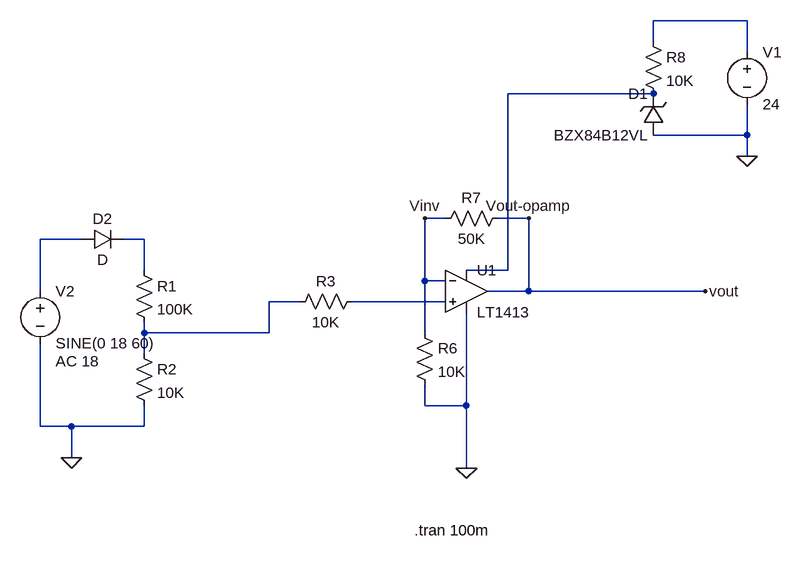
[diagram p0: schematic cspg_dc_voltage_sense_amp.asc]
cspg_dc_voltage_sense_amp.asc, the LTspice schematic file:
Version 4
SHEET 1 1316 680
WIRE 1056 -272 912 -272
WIRE 912 -240 912 -272
WIRE 1056 -224 1056 -272
WIRE 912 -160 688 -160
WIRE 1056 -96 1056 -144
WIRE 1056 -96 912 -96
WIRE 1056 -64 1056 -96
WIRE 592 32 560 32
WIRE 720 32 672 32
WIRE 32 64 -32 64
WIRE 128 64 96 64
WIRE 128 112 128 64
WIRE 688 112 688 -160
WIRE 688 112 624 112
WIRE 560 128 560 32
WIRE 592 128 560 128
WIRE -32 144 -32 64
WIRE 720 144 720 32
WIRE 720 144 656 144
WIRE 992 144 720 144
WIRE 368 160 320 160
WIRE 592 160 448 160
WIRE 128 208 128 192
WIRE 320 208 320 160
WIRE 320 208 128 208
WIRE 560 208 560 128
WIRE 128 240 128 208
WIRE 560 320 560 288
WIRE 624 320 624 176
WIRE 624 320 560 320
WIRE -32 352 -32 224
WIRE 16 352 -32 352
WIRE 128 352 128 320
WIRE 128 352 16 352
WIRE 16 400 16 352
WIRE 624 416 624 320
FLAG 1056 -64 0
FLAG 624 416 0
FLAG 560 32 Vinv
FLAG 720 32 Vout-opamp
FLAG 992 144 vout
FLAG 16 400 0
SYMBOL voltage 1056 -240 R0
WINDOW 123 0 0 Left 0
WINDOW 39 0 0 Left 0
SYMATTR InstName V1
SYMATTR Value 24
SYMBOL res 464 144 R90
WINDOW 0 0 56 VBottom 2
WINDOW 3 32 56 VTop 2
SYMATTR InstName R3
SYMATTR Value 10K
SYMBOL res 544 192 R0
SYMATTR InstName R6
SYMATTR Value 10K
SYMBOL res 688 16 R90
WINDOW 0 0 56 VBottom 2
WINDOW 3 32 56 VTop 2
SYMATTR InstName R7
SYMATTR Value 50K
SYMBOL Opamps\\LT1413 624 80 R0
SYMATTR InstName U1
SYMBOL res 896 -256 R0
SYMATTR InstName R8
SYMATTR Value 10K
SYMBOL zener 928 -96 R180
WINDOW 0 24 64 Left 2
WINDOW 3 24 0 Left 2
SYMATTR InstName D1
SYMATTR Value BZX84B12VL
SYMBOL voltage -32 128 R0
WINDOW 123 24 124 Left 2
WINDOW 39 0 0 Left 0
SYMATTR InstName V2
SYMATTR Value SINE(0 18 60)
SYMATTR Value2 AC 18
SYMBOL res 112 96 R0
SYMATTR InstName R1
SYMATTR Value 100K
SYMBOL res 112 224 R0
SYMATTR InstName R2
SYMATTR Value 10K
SYMBOL diode 32 80 R270
WINDOW 0 32 32 VTop 2
WINDOW 3 0 32 VBottom 2
SYMATTR InstName D2
TEXT 544 512 Left 2 !.tran 100m

The netlist it stands for:
* cspg_dc_voltage_sense_amp.asc
V1 N001 0 24
R3 N006 N005 10K
R6 Vinv 0 10K
R7 vout Vinv 50K
XU1 N006 Vinv N002 0 vout LT1413  ; pins In+ In- V+ V- OUT
R8 N001 N002 10K
D1 0 N002 BZX84B12VL
V2 N003 0 SINE(0 18 60) AC 18
R1 N004 N005 100K
R2 N005 0 10K
D2 N003 N004 D
.model D D
.lib standard.dio
.tran 100m
.lib LTC.lib
.backanno
.end